# Altium schematic sheet PIC18F14K50.SchDoc
size A
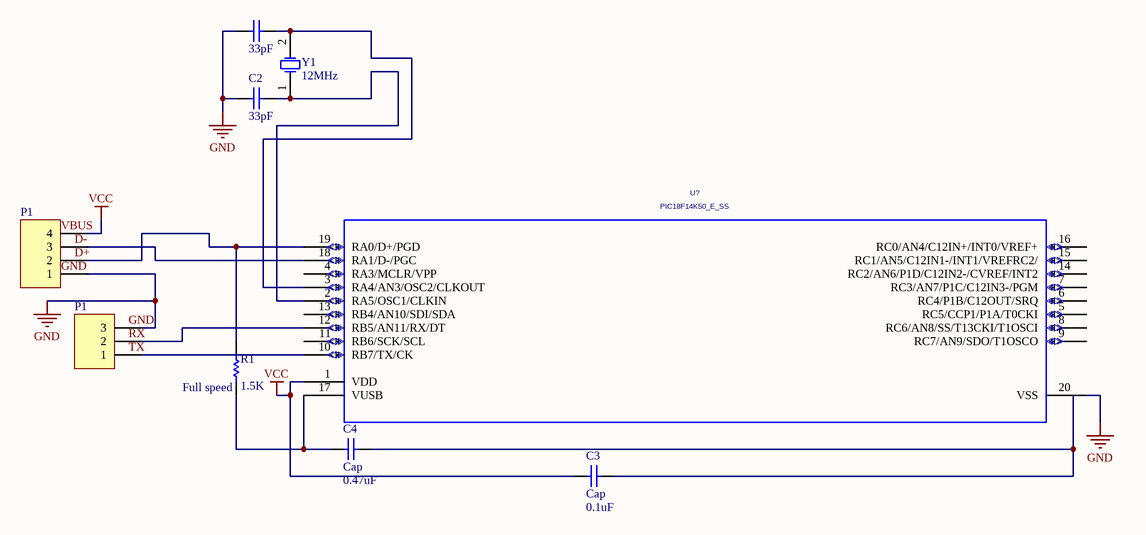
[diagram p0: PIC18F14K50.SchDoc]

## Parts
(Parts that share a designator on the sheet are numbered #1, #2 ... from top to bottom, then left to right.)
C1  value 33pF  [CAPC3216L]  (hidden comment: Cap Semi)
C2  value 33pF  [CAPC3216L]  (hidden comment: Cap Semi)
C3  Cap  value 0.1uF  [RAD-0.3]
C4  Cap  value 0.47uF  [RAD-0.3]
P1#1  Header 4  [HDR1X4]  (value not drawn)
P1#2  Header 3  [HDR1X3]  (value not drawn)
R1  Full speed  value 1.5K  [AXIAL-0.3]
U?  PIC18F14K50_E_SS  [PIC18F14K50_E_SS]
Y1  12MHz  [BCY-W2/D3.1]

## Nets
GND: C1.1 C2.1 P1#1.1 P1#2.3 U?.20(VSS)
VCC: C3.2 P1#1.4 U?.1(VDD)
NetC1_2: C1.2 U?.3(RA4/AN3/OSC2/CLKOUT) Y1.2(OSC2)
NetC2_2: C2.2 U?.2(RA5/OSC1/CLKIN) Y1.1(OSC1)
NetC3_1: C3.1 C4.1
NetC4_2: C4.2 R1.1 U?.17(VUSB)
NetP1#1_2: P1#1.2 R1.2 U?.19(RA0/D+/PGD)
NetP1#1_3: P1#1.3 U?.18(RA1/D-/PGC)
NetP1#2_1: P1#2.1 U?.10(RB7/TX/CK)
NetP1#2_2: P1#2.2 U?.12(RB5/AN11/RX/DT)

Not connected (* = marked no-connect by the designer): U? 4(RA3/MCLR/VPP) 5(RC5/CCP1/P1A/T0CKI) 6(RC4/P1B/C12OUT/SRQ) 7(RC3/AN7/P1C/C12IN3-/PGM) 8(RC6/AN8/SS/T13CKI/T1OSCI) 9(RC7/AN9/SDO/T1OSCO) 11(RB6/SCK/SCL) 13(RB4/AN10/SDI/SDA) 14(RC2/AN6/P1D/C12IN2-/CVREF/INT2) 15(RC1/AN5/C12IN1-/INT1/VREFRC2/) 16(RC0/AN4/C12IN+/INT0/VREF+)

## Notes on the sheet
- Labels drawn without touching a wire or pin: D+, D-, GND, RX, TX, VBUS

## Library data of the parts
C1 C2 = Cap Semi: Capacitor (Semiconductor SIM Model); Published: 8-Jun-2000; LatestRevisionDate: 29-May-2009; LatestRevisionNote: IPC-7351 Footprint Added.; PackageReference: C1206; Publisher: Altium Limited; PackageDescription: Chip Capacitor
C3 C4 = Cap: Capacitor; Published: 8-Jun-2000; LatestRevisionDate: 17-Jul-2002; LatestRevisionNote: Re-released for DXP Platform.; PackageReference: RAD-0.3; Publisher: Altium Limited
P1#1 = Header 4: Header, 4-Pin; LatestRevisionDate: 17-Jul-2002; LatestRevisionNote: Re-released for DXP Platform.; Publisher: Altium Limited
P1#2 = Header 3: Header, 3-Pin; LatestRevisionDate: 17-Jul-2002; LatestRevisionNote: Re-released for DXP Platform.; Publisher: Altium Limited
R1 = Res1: Resistor; Published: 8-Jun-2000; LatestRevisionDate: 17-Jul-2002; LatestRevisionNote: Re-released for DXP Platform.; PackageReference: AXIAL-0.3; Publisher: Altium Limited
Y1 = XTAL: Crystal Oscillator; Published: 8-Jun-2000; LatestRevisionDate: 17-Jul-2002; LatestRevisionNote: Re-released for DXP Platform.; PackageReference: R38; Publisher: Altium Limited; value: 12 Mhz
U? = PIC18F14K50_E_SS: Value: pic18f14k50_e_ss